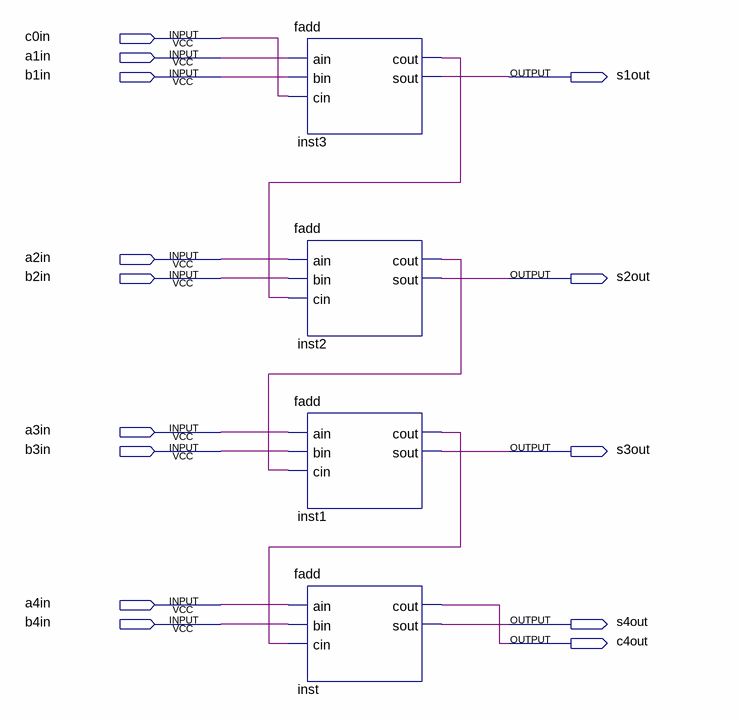
[diagram p0: schematic sheet]
// Quartus schematic hc283.bdf as structural Verilog: 4 symbols, 14 pins
module hc283 (
  input  c0in,
  input  a1in,
  input  b1in,
  input  a2in,
  input  b2in,
  input  a3in,
  input  b3in,
  input  a4in,
  input  b4in,
  output s1out,
  output s2out,
  output s3out,
  output s4out,
  output c4out
);

  wire inst1_cout, inst2_cout, inst3_cout;

  fadd inst3 (.ain(a1in), .bin(b1in), .cin(c0in), .cout(inst3_cout), .sout(s1out));
  fadd inst2 (.ain(a2in), .bin(b2in), .cin(inst3_cout), .cout(inst2_cout), .sout(s2out));
  fadd inst1 (.ain(a3in), .bin(b3in), .cin(inst2_cout), .cout(inst1_cout), .sout(s3out));
  fadd inst (.ain(a4in), .bin(b4in), .cin(inst1_cout), .cout(c4out), .sout(s4out));
endmodule
